# Altium project bldc_controller.PrjPcb
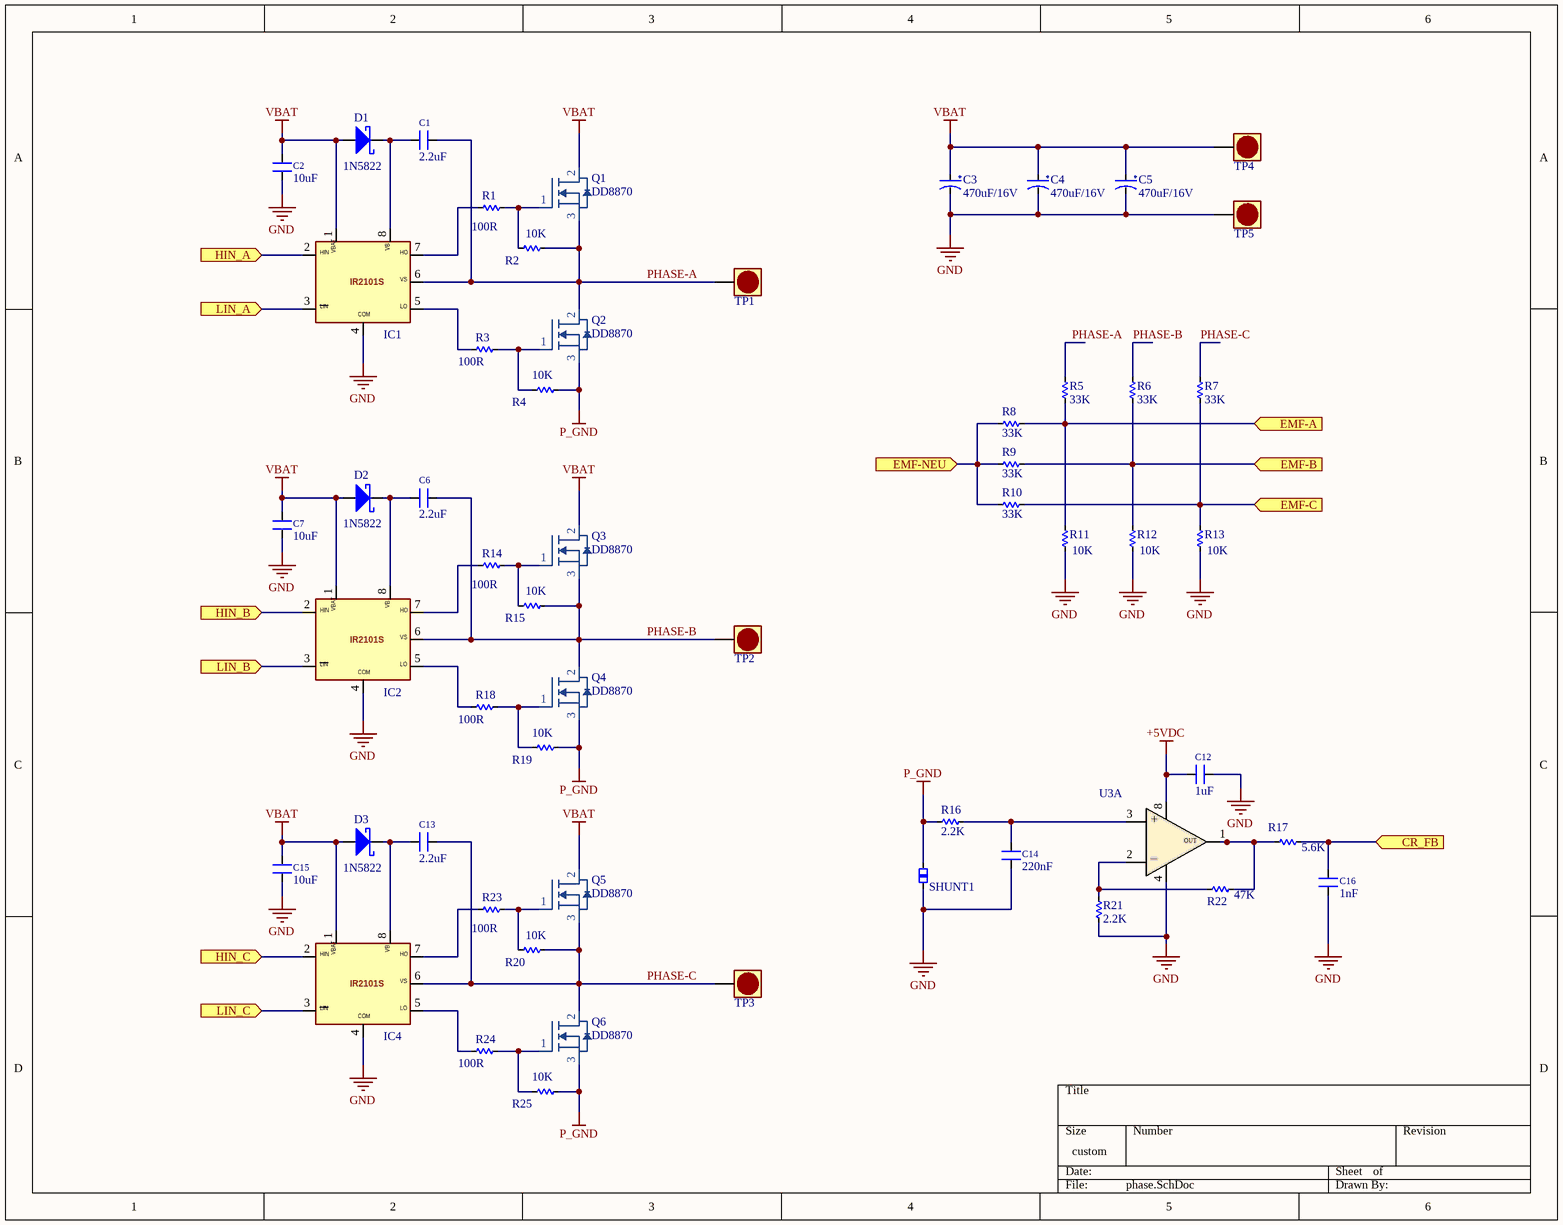
[diagram p0: phase.SchDoc]
2 sheets, 89 parts. Net scope: flat (ports and power ports of the same name join across sheets).
Board files: PCB1.PcbDoc, PCB2.PcbDoc, OK.PcbDoc
Sheets:
  phase.SchDoc
  MCU.SchDoc

## Sheet phase.SchDoc
size 292 x 228 mm; SheetNumber: 1; SheetTotal: 2

### Parts
C1  2.2uF  [CN-SMD-0805]
C2  10uF  [SM-CAP-0805]
C3  470uF/16V  [CAP-ALU-SMD-F]
C4  470uF/16V  [CAP-ALU-SMD-F]
C5  470uF/16V  [CAP-ALU-SMD-F]
C6  2.2uF  [CN-SMD-0805]
C7  10uF  [SM-CAP-0805]
C12  1uF  [CN-SMD-0805]
C13  2.2uF  [CN-SMD-0805]
C14  220nF  [CN-SMD-0805]
C15  10uF  [SM-CAP-0805]
C16  1nF  [CN-SMD-0805]
D1  1N5822  [DO-214AC]
D2  1N5822  [DO-214AC]
D3  1N5822  [DO-214AC]
IC1  IR2101S  [SOIC-8]  (value not drawn)
IC2  IR2101S  [SOIC-8]  (value not drawn)
IC4  IR2101S  [SOIC-8]  (value not drawn)
Q1  DD8870  [TO-252]
Q2  DD8870  [TO-252]
Q3  DD8870  [TO-252]
Q4  DD8870  [TO-252]
Q5  DD8870  [TO-252]
Q6  DD8870  [TO-252]
R1  100R  [RES-SMD-0805]
R2  10K  [RES-SMD-0805]
R3  100R  [RES-SMD-0805]
R4  10K  [RES-SMD-0805]
R5  33K  [RES-SMD-0603]
R6  33K  [RES-SMD-0603]
R7  33K  [RES-SMD-0603]
R8  33K  [RES-SMD-0603]
R9  33K  [RES-SMD-0603]
R10  33K  [RES-SMD-0603]
R11  10K  [RES-SMD-0603]
R12  10K  [RES-SMD-0603]
R13  10K  [RES-SMD-0603]
R14  100R  [RES-SMD-0805]
R15  10K  [RES-SMD-0805]
R16  2.2K  [RES-SMD-0805]
R17  5.6K  [RES-SMD-0805]
R18  100R  [RES-SMD-0805]
R19  10K  [RES-SMD-0805]
R20  10K  [RES-SMD-0805]
R21  2.2K  [RES-SMD-0805]
R22  47K  [RES-SMD-0805]
R23  100R  [RES-SMD-0805]
R24  100R  [RES-SMD-0805]
R25  10K  [RES-SMD-0805]
SHUNT1  Shunt  [SHUNT10MM]  (value not drawn)
TP1  JP1P  [PW-JP]  (value not drawn)
TP2  JP1P  [PW-JP]  (value not drawn)
TP3  JP1P  [PW-JP]  (value not drawn)
TP4  JP1P  [PW-JP]  (value not drawn)
TP5  JP1P  [PW-JP]  (value not drawn)
U3  MCP6002  [DIP-8]  (value not drawn)  (part A of 2)

### Ports
CR_FB (in), EMF-A (in), EMF-B (in), EMF-C (in), EMF-NEU (in), HIN_A (in), HIN_B (in), HIN_C (in), LIN_A (in), LIN_B (in), LIN_C (in)

### Nets
+5VDC: C12.1 U3.8
GND: C2.1 C3.2 C4.2 C5.2 C7.1 C12.2 C14.1 C15.1 C16.2 IC1.4 IC2.4 IC4.4 R11.2 R12.2 R13.2 R21.1 SHUNT1.1 TP5.1 U3.4
P_GND: Q2.3 Q4.3 Q6.3 R4.2 R16.1 R19.2 R25.2 SHUNT1.2
VBAT: C2.2 C3.1 C4.1 C5.1 C7.2 C15.2 D1.1 D2.1 D3.1 IC1.1 IC2.1 IC4.1 Q1.2 Q3.2 Q5.2 TP4.1
PHASE-A: C1.2 IC1.6 Q1.3 Q2.2 R2.2 R5.1 TP1.1
PHASE-B: C6.2 IC2.6 Q3.3 Q4.2 R6.1 R15.2 TP2.1
PHASE-C: C13.2 IC4.6 Q5.3 Q6.2 R7.1 R20.2 TP3.1
NetC1_1: C1.1 D1.2 IC1.8
NetC6_1: C6.1 D2.2 IC2.8
NetC13_1: C13.1 D3.2 IC4.8
NetC14_2: C14.2 R16.2 U3.3
NetC16_1: C16.1 R17.2 ; port CR_FB
NetIC1_2: IC1.2 ; port HIN_A
NetIC1_3: IC1.3 ; port LIN_A
NetIC1_5: IC1.5 R3.2
NetIC1_7: IC1.7 R1.2
NetIC2_2: IC2.2 ; port HIN_B
NetIC2_3: IC2.3 ; port LIN_B
NetIC2_5: IC2.5 R18.2
NetIC2_7: IC2.7 R14.2
NetIC4_2: IC4.2 ; port HIN_C
NetIC4_3: IC4.3 ; port LIN_C
NetIC4_5: IC4.5 R24.2
NetIC4_7: IC4.7 R23.2
NetQ1_1: Q1.1 R1.1 R2.1
NetQ2_1: Q2.1 R3.1 R4.1
NetQ3_1: Q3.1 R14.1 R15.1
NetQ4_1: Q4.1 R18.1 R19.1
NetQ5_1: Q5.1 R20.1 R23.1
NetQ6_1: Q6.1 R24.1 R25.1
NetR5_2: R5.2 R8.2 R11.1 ; port EMF-A
NetR6_2: R6.2 R9.2 R12.1 ; port EMF-B
NetR7_2: R7.2 R10.2 R13.1 ; port EMF-C
NetR8_1: R8.1 R9.1 R10.1 ; port EMF-NEU
NetR17_1: R17.1 R22.2 U3.1
NetR21_2: R21.2 R22.1 U3.2

### Notes on the sheet
- (in symbol IR2101S) VB; HIN; VBAT; HO; VS; LIN; LO; COM
- (in symbol MCP6002, part A) +; OUT; _

### Library data of the parts
C1 C2 C6 C7 C12-C16 = CAP SMD: Value: 0,1uF/300V; Designed by: VanDungEvn
C3-C5 = CAP-ALU-SMD: Published: 8-Jun-2000; LatestRevisionDate: 17-Jul-2002; LatestRevisionNote: Re-released for DXP Platform.; PackageReference: POLAR0.8; Publisher: Altium Limited
D1-D3 = Diode Schottky: Part Number: LED 3 ly Single Colour; Pricing: *
Q1-Q6 = MOSFET-N: MOSFET N chane
R1-R25 = Res-SMD: Resistor; Manufacturer: Generic Components; Class: Passive; Published: 08/06/2000; Publisher: Altium Hobart Technology Centre

## Sheet MCU.SchDoc
size A; SheetNumber: 2; SheetTotal: 2
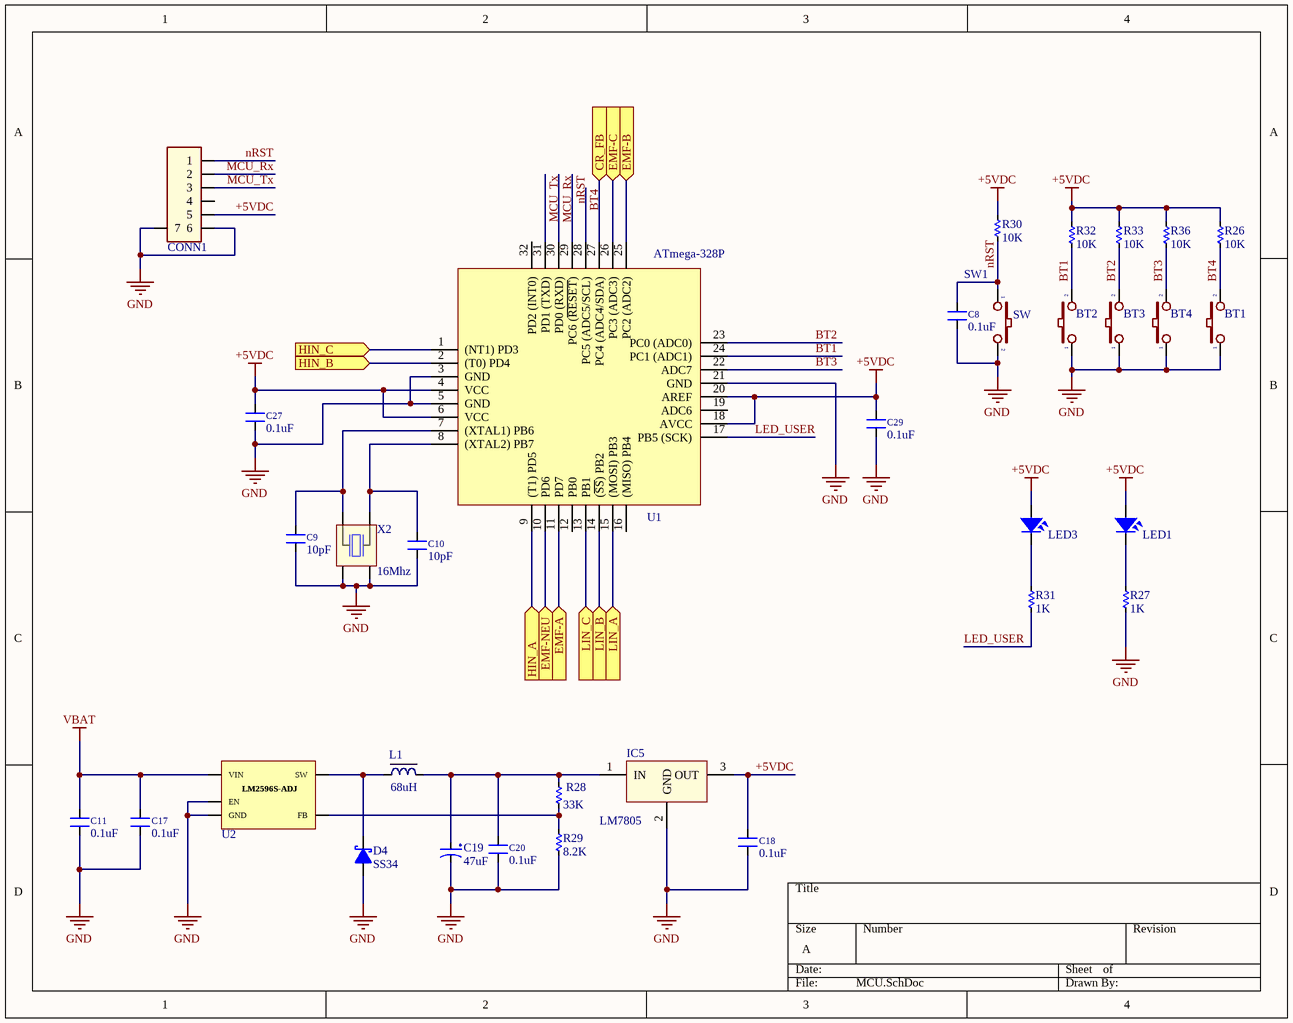
[diagram p1: MCU.SchDoc]

### Parts
BT1  BUTTON1  [SW4_SMD]  (value not drawn)
BT2  BUTTON1  [SW4_SMD]  (value not drawn)
BT3  BUTTON1  [SW4_SMD]  (value not drawn)
BT4  BUTTON1  [SW4_SMD]  (value not drawn)
C8  0.1uF  [CN-SMD-0603]
C9  10pF  [CN-SMD-0805]
C10  10pF  [CN-SMD-0805]
C11  0.1uF  [CN-SMD-1206]
C17  0.1uF  [CN-SMD-0805]
C18  0.1uF  [SM-CAP-0603]
C19  47uF  [CAP-ALU-SMD-6.3x7.7x2.2]
C20  0.1uF  [SM-CAP-0603]
C27  0.1uF  [SM-CAP-0603]
C29  0.1uF  [CN-SMD-0603]
CONN1  CONNECTOR 6P  [JST-PH2.0_6P]  (value not drawn)
D4  SS34  [DO-214AC(SMA)]
IC5  LM7805  [TO263-DDPAK]
L1  68uH  [L-SMD-CDRH127-M-12x7]
LED1  LED SMD  [SM-LED-0603]  (value not drawn)
LED3  LED SMD  [SM-LED-0603]  (value not drawn)
R26  10K  [RES-SMD-0603]
R27  1K  [RES-SMD-0603]
R28  33K  [RES-SMD-0805]
R29  8.2K  [RES-SMD-0805]
R30  10K  [RES-SMD-0603]
R31  1K  [RES-SMD-0603]
R32  10K  [RES-SMD-0603]
R33  10K  [RES-SMD-0603]
R36  10K  [RES-SMD-0603]
SW1  SW  [SW-SMD - 3x4]
U1  ATmega-328P  [TQFP32]
U2  LM2596S  [TO-263_5P]  (value not drawn)
X2  16Mhz  [XT4 SMD 3225]

### Ports
CR_FB (in), EMF-A (in), EMF-B (in), EMF-C (in), EMF-NEU (in), HIN_A (in), HIN_B (in), HIN_C (in), LIN_A (in), LIN_B (in), LIN_C (in)

### Nets
+5VDC: C18.2 C27.2 C29.2 CONN1.5 IC5.3(OUT) LED1.1 LED3.1 R26.2 R30.2 R32.2 R33.2 R36.2 U1.4(VCC) U1.6(VCC) U1.18(AVCC) U1.20(AREF)
GND: BT1.1 BT2.1 BT3.1 BT4.1 C8.2 C9.1 C10.1 C11.1 C17.1 C18.1 C19.2 C20.1 C27.1 C29.1 CONN1.6 CONN1.7 D4.A IC5.2(GND) R27.2 R29.2 SW1.2 U1.3(GND) U1.5(GND) U1.21(GND) U2.3(GND) U2.5(EN) X2.2(inp) X2.4(inp)
VBAT: C11.2 C17.2 U2.1(VIN)
BT1: BT2.2 R32.1 U1.24(PC1_(ADC1))
BT2: BT3.2 R33.1 U1.23(PC0_(ADC0))
BT3: BT4.2 R36.1 U1.22(ADC7)
BT4: BT1.2 R26.1 U1.28(PC5_(ADC5/SCL))
LED_USER: R31.2 U1.17(PB5_(SCK))
MCU_Rx: CONN1.2 U1.30(PD0_(RXD))
MCU_Tx: CONN1.3 U1.31(PD1_(TXD))
nRST: C8.1 CONN1.1 R30.1 SW1.1 U1.29(PC6_(~{RESET}))
NetC9_2: C9.2 U1.7((XTAL1)_PB6) X2.3(out)
NetC10_2: C10.2 U1.8((XTAL2)_PB7) X2.1(inp)
NetC16_1: U1.27(PC4_(ADC4/SDA)) ; port CR_FB
NetC19_1: C19.1 C20.2 IC5.1(IN) L1.2 R28.2
NetD4_K: D4.K L1.1 U2.2(SW)
NetIC1_2: U1.9((T1)_PD5) ; port HIN_A
NetIC1_3: U1.15((MOSI)_PB3) ; port LIN_A
NetIC2_2: U1.2((T0)_PD4) ; port HIN_B
NetIC2_3: U1.14((~{SS})_PB2) ; port LIN_B
NetIC4_2: U1.1((NT1)_PD3) ; port HIN_C
NetIC4_3: U1.13(PB1) ; port LIN_C
NetLED1_2: LED1.2 R27.1
NetLED3_2: LED3.2 R31.1
NetR5_2: U1.11(PD7) ; port EMF-A
NetR6_2: U1.25(PC2_(ADC2)) ; port EMF-B
NetR7_2: U1.26(PC3_(ADC3)) ; port EMF-C
NetR8_1: U1.10(PD6) ; port EMF-NEU
NetR28_1: R28.1 R29.1 U2.4(FB)

Not connected (* = marked no-connect by the designer): CONN1 4; U1 12(PB0) 16((MISO)_PB4) 19(ADC6) 32(PD2_(INT0))

### Notes on the sheet
- (in symbol LM2596S) LM2596S-ADJ

### Library data of the parts
BT1-BT4 = BUTTON1: Value: 1N4007
C8-C11 C17 C18 C20 C27 C29 = CAP SMD: as C1 on sheet phase
C19 = CAP-ALU-SMD: Published: 8-Jun-2000; LatestRevisionDate: 17-Jul-2002; LatestRevisionNote: Re-released for DXP Platform.; PackageReference: POLAR0.8; Publisher: Altium Limited
D4 = Diode  Schottky: pin to pad: A>1 K>2; Value: 1N4007
IC5 = LM78xx: On ap +, from + 5 to + 24VDC; Value: LM7805
L1 = inductor-SMD: Value: 150 mH
LED1 LED3 = LED-SMD-0805
R26-R33 R36 = Res-SMD: as R1 on sheet phase; Published: 08/06/2000; Publisher: Altium Hobart Technology Centre
SW1 = SW2: Switch button 2 pin; Value: SW chip 2 pin
U1 = Atmega328P-SMD: Atmega328psmd
X2 = XTAL SMD 4PIN: XTAL SMD 3225, 12MHz, Cl=18pF, Tol: ±30ppm, Stab: ±30ppm

## Nets that join several sheets
+5VDC: phase (C12.1 U3.8), MCU (16 pins)
GND: phase (19 pins), MCU (28 pins)
VBAT: phase (16 pins), MCU (C11.2 C17.2 U2.1)
NetC16_1: phase (C16.1 R17.2), MCU (U1.27)
NetIC1_2: phase (IC1.2), MCU (U1.9)
NetIC1_3: phase (IC1.3), MCU (U1.15)
NetIC2_2: phase (IC2.2), MCU (U1.2)
NetIC2_3: phase (IC2.3), MCU (U1.14)
NetIC4_2: phase (IC4.2), MCU (U1.1)
NetIC4_3: phase (IC4.3), MCU (U1.13)
NetR5_2: phase (R5.2 R8.2 R11.1), MCU (U1.11)
NetR6_2: phase (R6.2 R9.2 R12.1), MCU (U1.25)
NetR7_2: phase (R7.2 R10.2 R13.1), MCU (U1.26)
NetR8_1: phase (R8.1 R9.1 R10.1), MCU (U1.10)